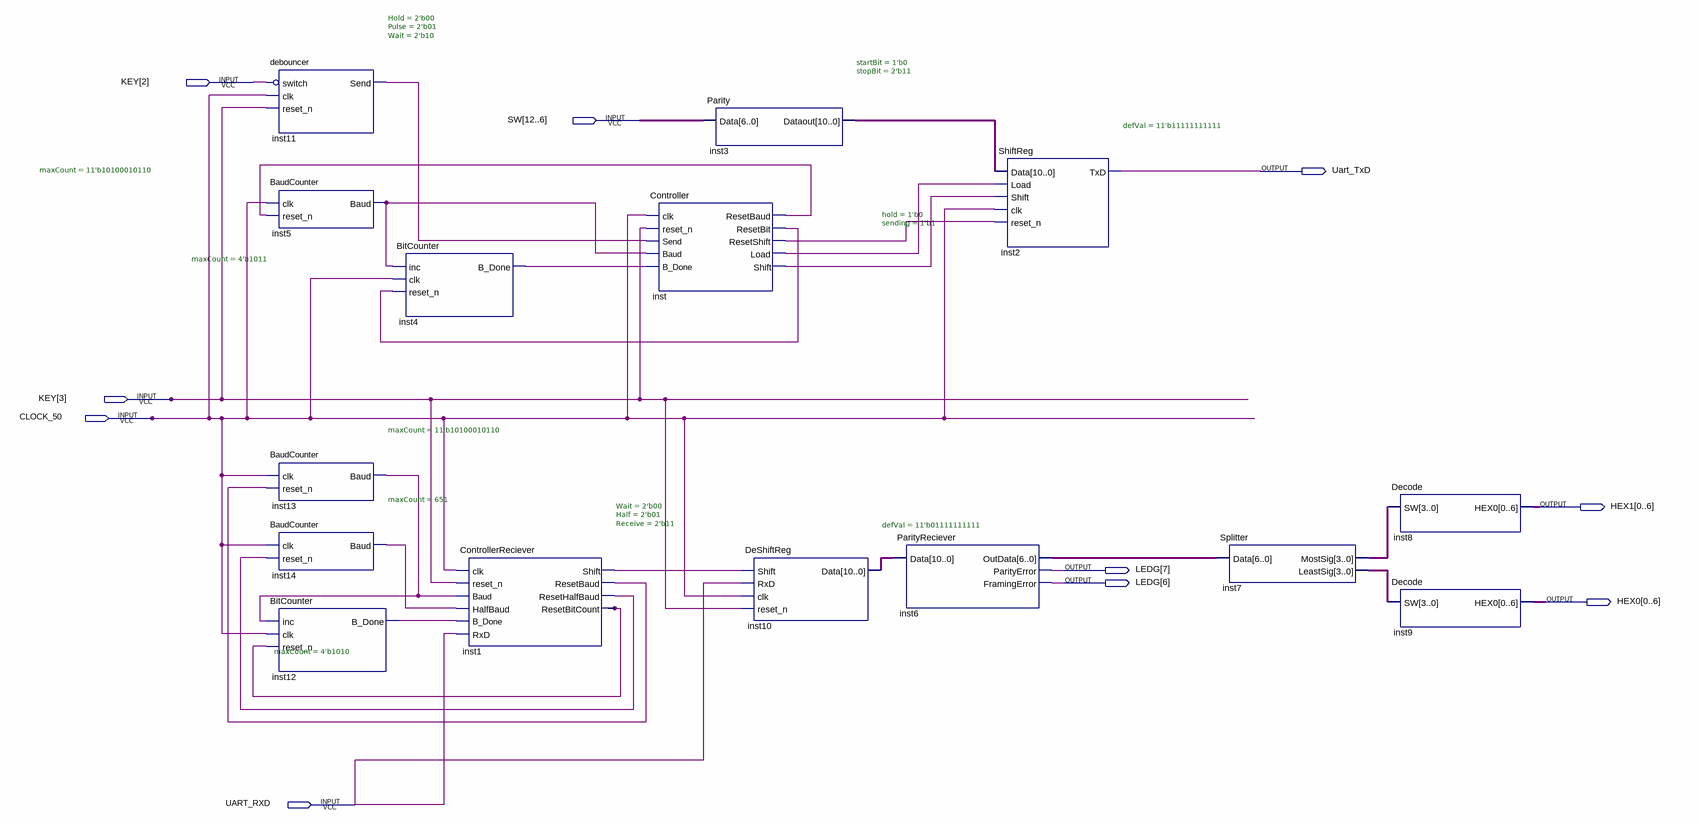
[diagram p0: schematic sheet]
// Quartus schematic UART.bdf as structural Verilog: 15 symbols, 10 pins
module UART (
  input  [3:2] KEY,
  input  [12:6] SW,
  input  CLOCK_50,
  input  UART_RXD,
  output Uart_TxD,
  output [0:6] HEX1,
  output [7:6] LEDG,
  output [0:6] HEX0
);

  wire inst1_resetbaud, inst1_resetbitcount, inst1_resethalfbaud, inst1_shift, inst4_b_done, inst5_baud,
       inst11_send, inst12_b_done, inst13_baud, inst14_baud, inst_load, inst_resetbaud, inst_resetbit,
       inst_resetshift, inst_shift;
  wire [3:0] inst7_leastsig, inst7_mostsig;
  wire [6:0] inst6_outdata;
  wire [10:0] inst3_dataout, inst10_data;

  debouncer #(.Hold(2'b00), .Pulse(2'b01), .Wait(2'b10)) inst11 (
    .clk(CLOCK_50), .reset_n(KEY[3]), .switch(~KEY[2]), .Send(inst11_send));
  BaudCounter #(.maxCount(11'b10100010110)) inst5 (.clk(CLOCK_50), .reset_n(inst_resetbaud), .Baud(inst5_baud));
  BaudCounter #(.maxCount(11'b10100010110)) inst13 (.clk(CLOCK_50), .reset_n(inst1_resetbaud), .Baud(inst13_baud));
  BaudCounter #(.maxCount(651)) inst14 (.clk(CLOCK_50), .reset_n(inst1_resethalfbaud), .Baud(inst14_baud));
  BitCounter #(.maxCount(4'b1010)) inst12 (
    .inc(inst13_baud), .clk(CLOCK_50), .reset_n(inst1_resetbitcount), .B_Done(inst12_b_done));
  BitCounter #(.maxCount(4'b1011)) inst4 (
    .inc(inst5_baud), .clk(CLOCK_50), .reset_n(inst_resetbit), .B_Done(inst4_b_done));
  ControllerReciever #(.Wait(2'b00), .Half(2'b01), .Receive(2'b11)) inst1 (
    .clk(CLOCK_50), .reset_n(KEY[3]), .Baud(inst13_baud), .HalfBaud(inst14_baud), .B_Done(inst12_b_done),
    .RxD(UART_RXD), .Shift(inst1_shift), .ResetBaud(inst1_resetbaud), .ResetHalfBaud(inst1_resethalfbaud),
    .ResetBitCount(inst1_resetbitcount));
  Controller #(.hold(1'b0), .sending(1'b1)) inst (
    .B_Done(inst4_b_done), .Baud(inst5_baud), .Send(inst11_send), .clk(CLOCK_50), .reset_n(KEY[3]),
    .Load(inst_load), .ResetBaud(inst_resetbaud), .ResetBit(inst_resetbit), .ResetShift(inst_resetshift),
    .Shift(inst_shift));
  Parity #(.startBit(1'b0), .stopBit(2'b11)) inst3 (.Data(SW), .Dataout(inst3_dataout));
  DeShiftReg #(.defVal(11'b01111111111)) inst10 (
    .Shift(inst1_shift), .RxD(UART_RXD), .clk(CLOCK_50), .reset_n(KEY[3]), .Data(inst10_data));
  ParityReciever inst6 (.Data(inst10_data), .OutData(inst6_outdata), .ParityError(LEDG[7]), .FramingError(LEDG[6]));
  ShiftReg #(.defVal(11'b11111111111)) inst2 (
    .Data(inst3_dataout), .Load(inst_load), .Shift(inst_shift), .clk(CLOCK_50), .reset_n(inst_resetshift),
    .TxD(Uart_TxD));
  Splitter inst7 (.Data(inst6_outdata), .MostSig(inst7_mostsig), .LeastSig(inst7_leastsig));
  Decode inst8 (.SW(inst7_mostsig), .HEX0(HEX1));
  Decode inst9 (.SW(inst7_leastsig), .HEX0(HEX0));
endmodule
